# EAGLE design General IO (EAGLE 4.13)
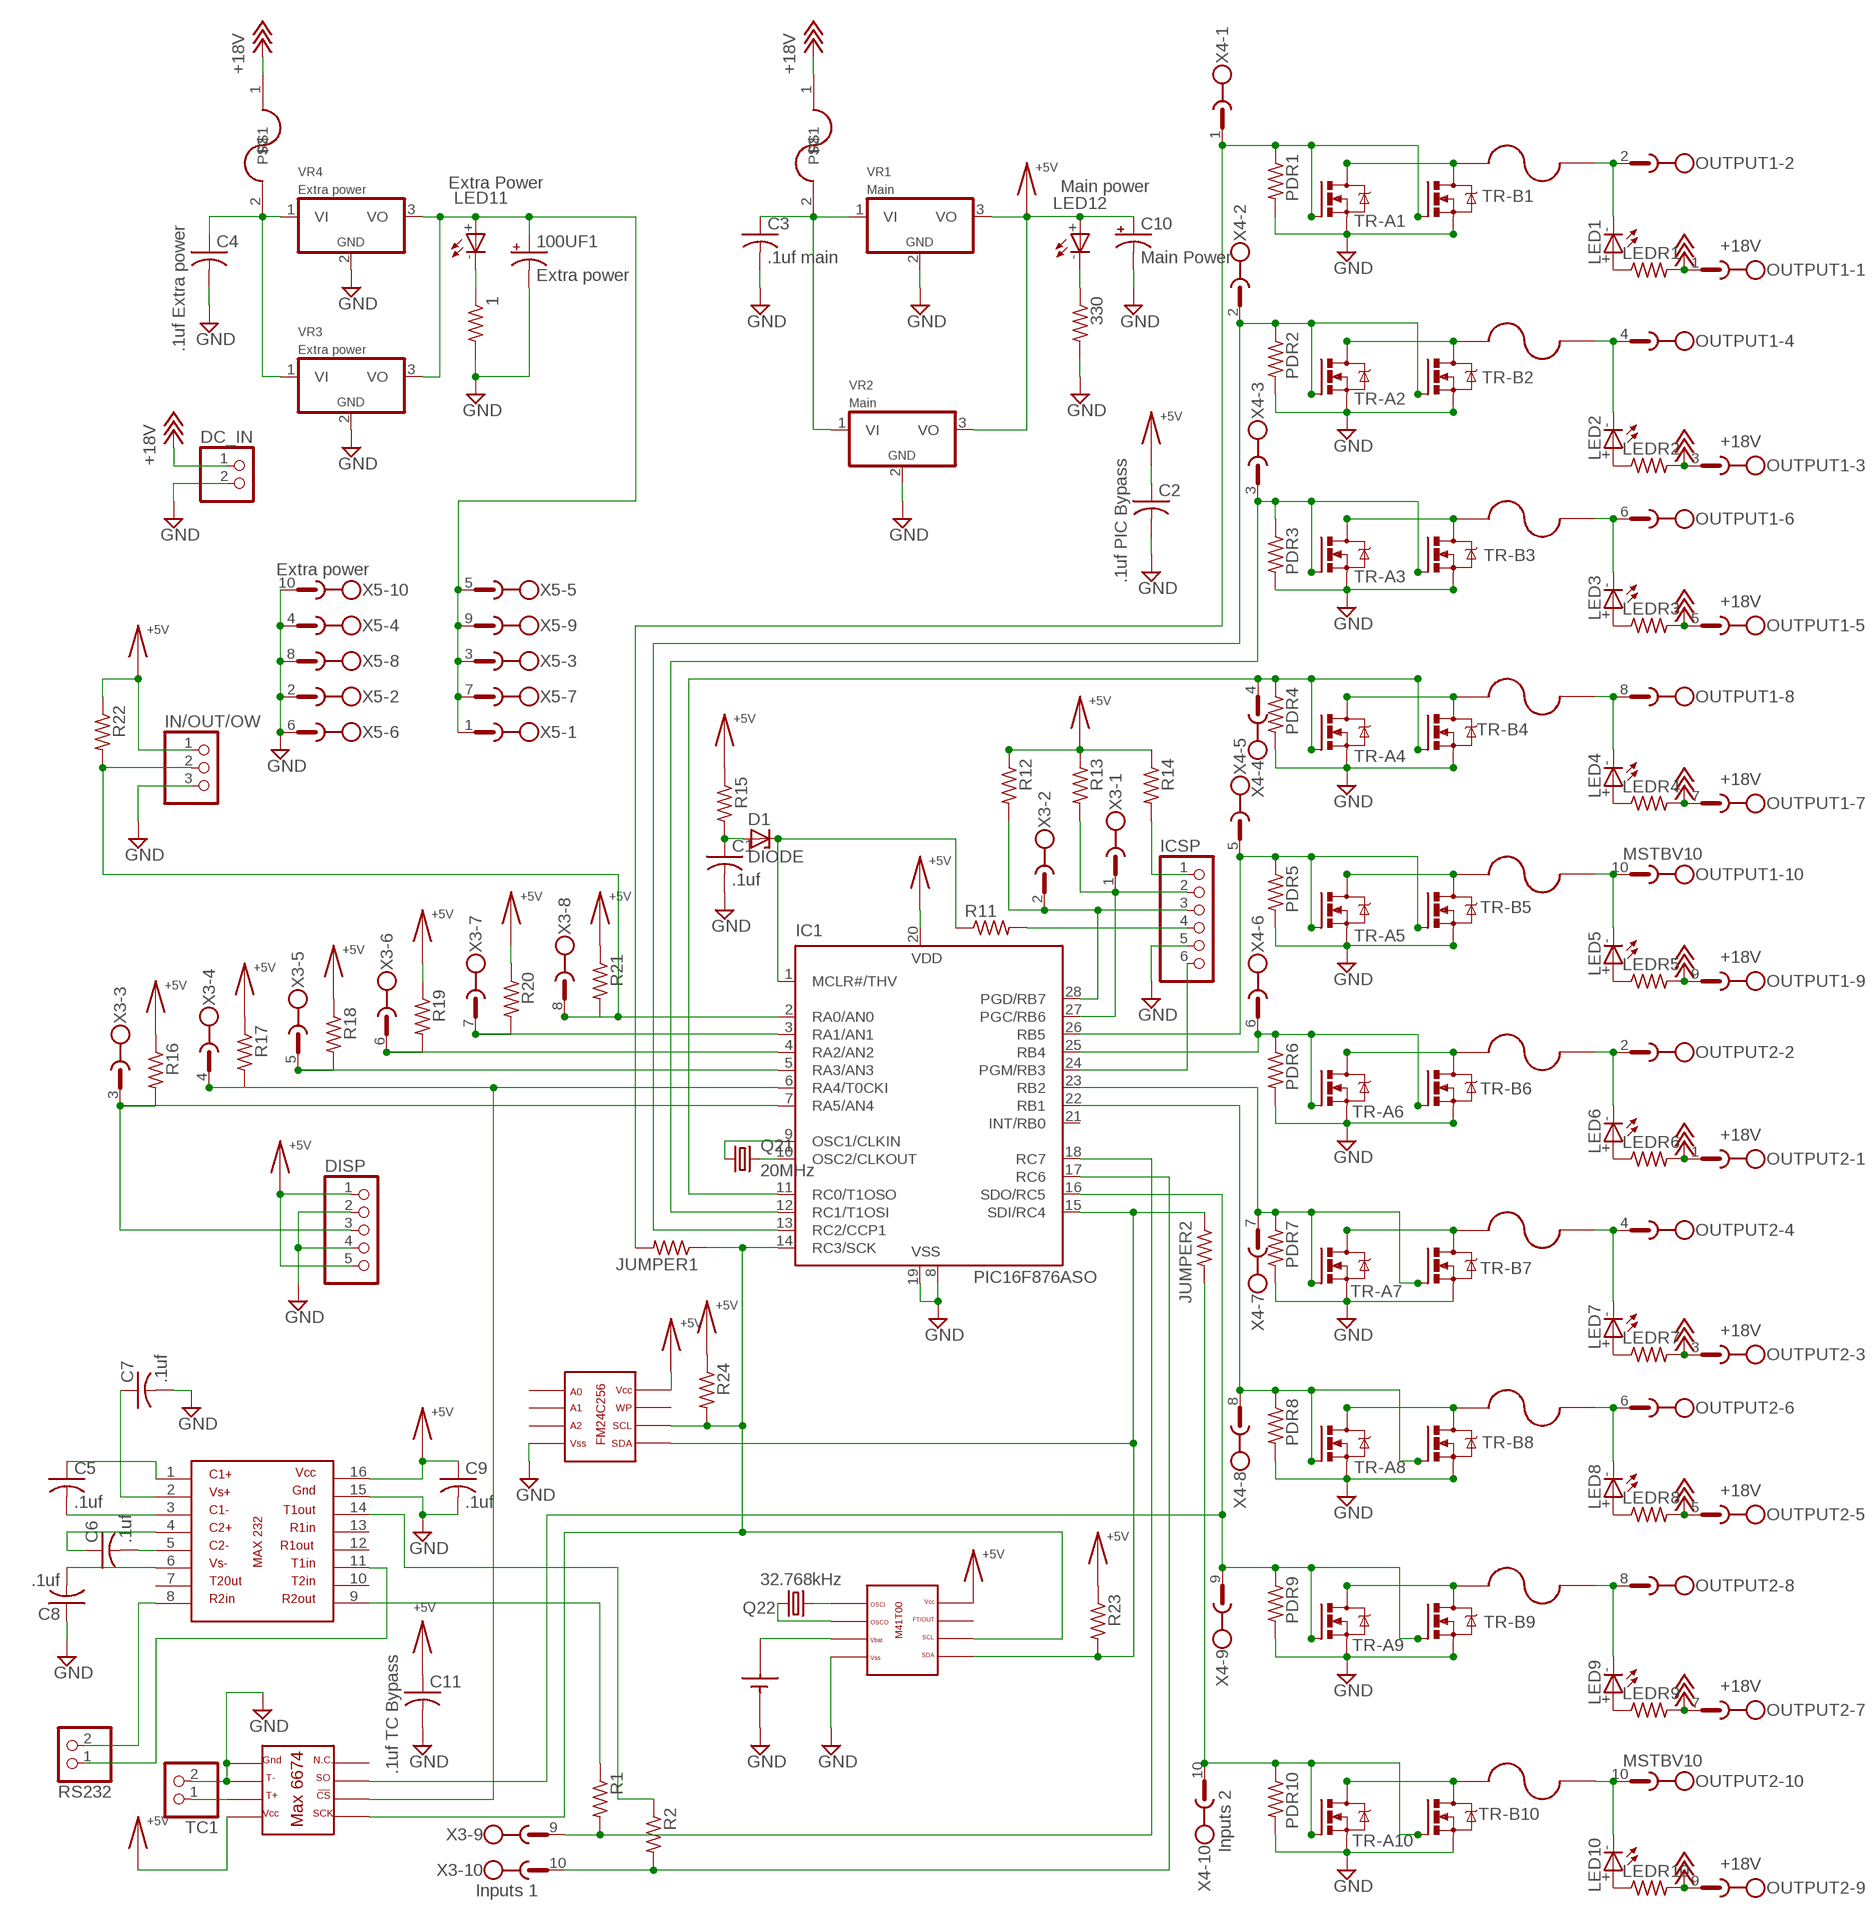
[diagram p0: schematic, sheet 1]

## Parts
1  RESISITORR1210  [R1210]
100UF1  Extra power  CAPACITOR-ELECTROLYTICG  [PANASONIC_G]
330  RESISITORR1210  [R1210]
BAT1  BH-401  [BH-401]
C1  .1uf  CAPACITOR-NO-POLARITYC1210  [C1210]
C2  .1uf PIC Bypass  CAPACITOR-NO-POLARITYC1210  [C1210]
C3  .1uf main  CAPACITOR-NO-POLARITYC1210  [C1210]
C4  .1uf Extra power  CAPACITOR-NO-POLARITYC1210  [C1210]
C5  .1uf  CAPACITOR-NO-POLARITYC1210  [C1210]
C6  .1uf  CAPACITOR-NO-POLARITYC1210  [C1210]
C7  .1uf  CAPACITOR-NO-POLARITYC1210  [C1210]
C8  .1uf  CAPACITOR-NO-POLARITYC1210  [C1210]
C9  .1uf  CAPACITOR-NO-POLARITYC1210  [C1210]
C10  Main Power  CAPACITOR-ELECTROLYTICG  [PANASONIC_G]
C11  .1uf TC Bypass  CAPACITOR-NO-POLARITYC1210  [C1210]
D1  DIODE  DIODE-SWITCHING  [SOT323-W]
DC_IN  PINHD-1X2  [1X02]
DISP  PINHD-1X5  [1X05]
FUSE1  FUSE(SM)  [FUSE]
FUSE2  FUSE(SM)  [FUSE]
FUSE3  FUSE(SM)  [FUSE]
FUSE4  FUSE(SM)  [FUSE]
FUSE5  FUSE(SM)  [FUSE]
FUSE6  FUSE(SM)  [FUSE]
FUSE7  FUSE(SM)  [FUSE]
FUSE8  FUSE(SM)  [FUSE]
FUSE9  FUSE(SM)  [FUSE]
FUSE10  FUSE(SM)  [FUSE]
IC1  PIC16F876ASO  PIC16F876SO  [SO-28W]
ICSP  PINHD-1X6  [1X06]
IN/OUT/OW  PINHD-1X3  [1X03]
JUMPER1  RESISITORM1406  [M1406]
JUMPER2  RESISITORM1406  [M1406]
LED1  LED  [1206]
LED2  LED  [1206]
LED3  LED  [1206]
LED4  LED  [1206]
LED5  LED  [1206]
LED6  LED  [1206]
LED7  LED  [1206]
LED8  LED  [1206]
LED9  LED  [1206]
LED10  LED  [1206]
LED11  Extra Power  LED  [1206]
LED12  Main power  LED  [1206]
LEDR1  RESISITORM1406  [M1406]
LEDR2  RESISITORM1406  [M1406]
LEDR3  RESISITORM1406  [M1406]
LEDR4  RESISITORM1406  [M1406]
LEDR5  RESISITORM1406  [M1406]
LEDR6  RESISITORM1406  [M1406]
LEDR7  RESISITORM1406  [M1406]
LEDR8  RESISITORM1406  [M1406]
LEDR9  RESISITORM1406  [M1406]
LEDR10  RESISITORM1406  [M1406]
OUTPUT1  MSTBV10  [MSTBV10]
OUTPUT2  MSTBV10  [MSTBV10]
PDR1  RESISITORM1406  [M1406]
PDR2  RESISITORM1406  [M1406]
PDR3  RESISITORM1406  [M1406]
PDR4  RESISITORM1406  [M1406]
PDR5  RESISITORM1406  [M1406]
PDR6  RESISITORM1406  [M1406]
PDR7  RESISITORM1406  [M1406]
PDR8  RESISITORM1406  [M1406]
PDR9  RESISITORM1406  [M1406]
PDR10  RESISITORM1406  [M1406]
POLYFUSE1  Extra Power  POLYFUSE  [0204/5]
POLYFUSE2  Main power  POLYFUSE  [0204/5]
Q21  20MHz  CRYSTALSM49  [SM49]
Q22  32.768kHz  CRYSTALTC26H  [TC26H]
R1  RESISITORM1406  [M1406]
R2  RESISITORM1406  [M1406]
R11  RESISITORR1210  [R1210]
R12  RESISITORM1406  [M1406]
R13  RESISITORM1406  [M1406]
R14  RESISITORM1406  [M1406]
R15  RESISITORR1210  [R1210]
R16  RESISITORM1406  [M1406]
R17  RESISITORM1406  [M1406]
R18  RESISITORM1406  [M1406]
R19  RESISITORM1406  [M1406]
R20  RESISITORM1406  [M1406]
R21  RESISITORM1406  [M1406]
R22  RESISITORR1210  [R1210]
R23  RESISITORM1406  [M1406]
R24  RESISITORM1406  [M1406]
RS232  PINHD-1X2  [1X02]
TC1  PINHD-1X2  [1X02]
TR-A1  ZXMN10A08GSOT223  [SOT223R_INFINEON]
TR-A2  ZXMN10A08GSOT223  [SOT223R_INFINEON]
TR-A3  ZXMN10A08GSOT223  [SOT223R_INFINEON]
TR-A4  ZXMN10A08GSOT223  [SOT223R_INFINEON]
TR-A5  ZXMN10A08GSOT223  [SOT223R_INFINEON]
TR-A6  ZXMN10A08GSOT223  [SOT223R_INFINEON]
TR-A7  ZXMN10A08GSOT223  [SOT223R_INFINEON]
TR-A8  ZXMN10A08GSOT223  [SOT223R_INFINEON]
TR-A9  ZXMN10A08GSOT223  [SOT223R_INFINEON]
TR-A10  ZXMN10A08GSOT223  [SOT223R_INFINEON]
TR-B1  ZXMN10A08G  [TO220BV]
TR-B2  ZXMN10A08G  [TO220BV]
TR-B3  ZXMN10A08G  [TO220BV]
TR-B4  ZXMN10A08G  [TO220BV]
TR-B5  ZXMN10A08G  [TO220BV]
TR-B6  ZXMN10A08G  [TO220BV]
TR-B7  ZXMN10A08G  [TO220BV]
TR-B8  ZXMN10A08G  [TO220BV]
TR-B9  ZXMN10A08G  [TO220BV]
TR-B10  ZXMN10A08G  [TO220BV]
U$1  MAX232  [SO16]
U$2  MAX6674  [SO08]
U$4  M41T00TIMER-I2C  [SO08]
U$18  FM24C256  [SO08]
VR1  Main  VOLTAGE-REGULATOR  [TO220S]
VR2  Main  VOLTAGE-REGULATORSO-223  [SOT223R_INFINEON]
VR3  Extra power  VOLTAGE-REGULATORSO-223  [SOT223R_INFINEON]
VR4  Extra power  VOLTAGE-REGULATOR  [TO220S]
X3  Inputs 1  MSTBV10  [MSTBV10]
X4  Inputs 2  MSTBV10  [MSTBV10]
X5  Extra power  MSTBV10  [MSTBV10]

## Nets
+5V: C2.1 C9.1 C10.+ C11.1 DISP.1 DISP.5 IC1.20(VDD) IN/OUT/OW.1 LED12.+ R12.1 R13.1 R14.1 R15.1 R16.1 R17.1 R18.1 R19.1 R20.1 R21.1 R22.1 R23.1 R24.1 U$1.16 U$2.4 U$4.8(VCC) U$18.8(VDD) VR1.3(VO) VR2.3(VO)
+18V: DC_IN.1 LEDR1.2 LEDR2.2 LEDR3.2 LEDR4.2 LEDR5.2 LEDR6.2 LEDR7.2 LEDR8.2 LEDR9.2 LEDR10.2 OUTPUT1.1 OUTPUT1.3 OUTPUT1.5 OUTPUT1.7 OUTPUT1.9 OUTPUT2.1 OUTPUT2.3 OUTPUT2.5 OUTPUT2.7 OUTPUT2.9 POLYFUSE1.1 POLYFUSE2.1
GND: 1.2 100UF1.- 330.2 BAT1.P$2 C1.2 C2.2 C3.2 C4.2 C7.2 C8.1 C9.2 C10.- C11.2 DC_IN.2 DISP.2 DISP.4 IC1.8(VSS) IC1.19(VSS) ICSP.5 IN/OUT/OW.3 PDR1.2 PDR2.2 PDR3.2 PDR4.2 PDR5.2 PDR6.2 PDR7.2 PDR8.2 PDR9.2 PDR10.2 TC1.2 TR-A1.3(S) TR-A2.3(S) TR-A3.3(S) TR-A4.3(S) TR-A5.3(S) TR-A6.3(S) TR-A7.3(S) TR-A8.3(S) TR-A9.3(S) TR-A10.3(S) TR-B1.S TR-B2.S TR-B3.S TR-B4.S TR-B5.S TR-B6.S TR-B7.S TR-B8.S TR-B9.S TR-B10.S U$1.15 U$2.1 U$2.2 U$4.4(VSS) U$18.4(VSS) VR1.2(GND) VR2.2(GND) VR3.2(GND) VR4.2(GND) X5.2 X5.4 X5.6 X5.8 X5.10
N$1: FUSE7.P$1 TR-A7.2(D) TR-B7.D
N$2: FUSE9.P$1 TR-A9.2(D) TR-B9.D
N$3: IC1.25(RB4) PDR6.1 TR-A6.1(G) TR-B6.G X4.6
N$4: FUSE6.P$2 LED6.- OUTPUT2.2
N$5: FUSE7.P$2 LED7.- OUTPUT2.4
N$6: FUSE6.P$1 TR-A6.2(D) TR-B6.D
N$7: FUSE8.P$1 TR-A8.2(D) TR-B8.D
N$8: IC1.23(RB2) PDR7.1 TR-A7.1(G) TR-B7.G X4.7
N$9: FUSE10.P$2 LED10.- OUTPUT2.10
N$10: FUSE8.P$2 LED8.- OUTPUT2.6
N$11: IC1.16(SDO/RC5) PDR9.1 TR-A9.1(G) TR-B9.G U$2.7 X4.9
N$12: IC1.22(RB1) PDR8.1 TR-A8.1(G) TR-B8.G X4.8
N$13: FUSE9.P$2 LED9.- OUTPUT2.8
N$14: FUSE10.P$1 TR-A10.2(D) TR-B10.D
N$15: JUMPER2.2 PDR10.1 TR-A10.1(G) TR-B10.G X4.10
N$16: FUSE2.P$2 LED2.- OUTPUT1.4
N$17: FUSE5.P$1 TR-A5.2(D) TR-B5.D
N$18: FUSE5.P$2 LED5.- OUTPUT1.10
N$19: IC1.24(PGM/RB3) ICSP.6
N$20: IC1.26(RB5) PDR5.1 TR-A5.1(G) TR-B5.G X4.5
N$21: FUSE4.P$1 TR-A4.2(D) TR-B4.D
N$22: FUSE4.P$2 LED4.- OUTPUT1.8
N$23: FUSE3.P$1 TR-A3.2(D) TR-B3.D
N$24: FUSE3.P$2 LED3.- OUTPUT1.6
N$25: IC1.12(RC1/T1OSI) PDR3.1 TR-A3.1(G) TR-B3.G X4.3
N$26: JUMPER1.2 PDR1.1 TR-A1.1(G) TR-B1.G X4.1
N$27: FUSE2.P$1 TR-A2.2(D) TR-B2.D
N$28: IC1.13(RC2/CCP1) PDR2.1 TR-A2.1(G) TR-B2.G X4.2
N$29: FUSE1.P$1 TR-A1.2(D) TR-B1.D
N$30: FUSE1.P$2 LED1.- OUTPUT1.2
N$31: IC1.28(PGD/RB7) ICSP.3 R12.2 X3.2
N$32: IC1.11(RC0/T1OSO) PDR4.1 TR-A4.1(G) TR-B4.G X4.4
N$33: DISP.3 IC1.7(RA5/AN4) R16.2 X3.3
N$34: ICSP.4 R11.2
N$35: IC1.10(OSC2/CLKOUT) Q21.2
N$36: C1.1 D1.1(A) R15.2
N$37: D1.3(C) IC1.1(MCLR#/THV) R11.1
N$38: ICSP.1 R14.2
N$39: IC1.9(OSC1/CLKIN) Q21.1
N$40: IC1.27(PGC/RB6) ICSP.2 R13.2 X3.1
N$41: IC1.6(RA4/T0CKI) R17.2 U$2.6 X3.4
N$42: IC1.5(RA3/AN3) R18.2 X3.5
N$43: IC1.4(RA2/AN2) R19.2 X3.6
N$44: IC1.3(RA1/AN1) R20.2 X3.7
N$45: IC1.2(RA0/AN0) IN/OUT/OW.2 R21.2 R22.2 X3.8
N$46: TC1.1 U$2.3
N$47: IC1.17(RC6) R2.2 X3.10
N$49: IC1.14(RC3/SCK) JUMPER1.1 R24.2 U$2.5 U$4.6(SCL) U$18.6(SCL)
N$52: IC1.15(SDI/RC4) JUMPER2.1 R23.2 U$4.5(SDA) U$18.5(SDA)
N$53: Q22.1 U$4.2(OSCO)
N$54: Q22.2 U$4.1(OSCI)
N$55: 330.1 LED12.-
N$56: BAT1.P$1 U$4.3(VBAT)
N$62: C4.1 POLYFUSE1.2 VR3.1(VI) VR4.1(VI)
N$63: C3.1 POLYFUSE2.2 VR1.1(VI) VR2.1(VI)
N$64: LED10.+ LEDR10.1
N$65: LED9.+ LEDR9.1
N$66: 1.1 LED11.-
N$67: LED8.+ LEDR8.1
N$68: 100UF1.+ LED11.+ VR3.3(VO) VR4.3(VO) X5.1 X5.3 X5.5 X5.7 X5.9
N$69: LED7.+ LEDR7.1
N$70: LED6.+ LEDR6.1
N$71: LED5.+ LEDR5.1
N$72: LED4.+ LEDR4.1
N$73: LED3.+ LEDR3.1
N$74: LED2.+ LEDR2.1
N$75: LED1.+ LEDR1.1
N$80: C6.2 U$1.5
N$81: C5.2 U$1.3
N$82: C6.1 U$1.4
N$83: C5.1 U$1.1
N$84: C7.1 U$1.2
N$85: C8.2 U$1.6
N$86: IC1.18(RC7) R1.2 X3.9
N$87: R1.1 U$1.9
N$88: R2.1 U$1.14
N$89: RS232.1 U$1.11
N$90: RS232.2 U$1.8
Unconnected: IC1.21(INT/RB0) U$1.7 U$1.10 U$1.12 U$1.13 U$2.8 U$4.7(FT/OUT) U$18.1(A0) U$18.2(A1) U$18.3(A2) U$18.7(WP)

## Library data of the parts
1 330 JUMPER1 JUMPER2 LEDR1-LEDR10 PDR1-PDR10 R1 R2 R11-R24 = 1 Dan's Common Parts:RESISITOR: RESISTOR, American symbol
100UF1 C10 = 1 Dan's Common Parts:CAPACITOR-ELECTROLYTIC: POLARIZED CAPACITOR, American symbol
BAT1 = 1 Dan's Common Parts:BH-401
C1-C9 C11 = 1 Dan's Common Parts:CAPACITOR-NO-POLARITY: CAPACITOR, American symbol
D1 = 1 Dan's Common Parts:DIODE-SWITCHING: Z DIODE
DC_IN RS232 TC1 = pinhead:PINHD-1X2: PIN HEADER
DISP = pinhead:PINHD-1X5: PIN HEADER
FUSE1-FUSE10 = 1 Dan's Common Parts:FUSE(SM)
IC1 = 1 Dan's Common Parts:PIC16*876: MICROCONTROLLER flash type
ICSP = pinhead:PINHD-1X6: PIN HEADER
IN/OUT/OW = pinhead:PINHD-1X3: PIN HEADER
LED1-LED12 = 1 Dan's Common Parts:LED
OUTPUT1 OUTPUT2 X3-X5 = con-phoenix-508:MSTBV10: PHOENIX
POLYFUSE1 POLYFUSE2 = 1 Dan's Common Parts:POLYFUSE
Q21 Q22 = 1 Dan's Common Parts:CRYSTAL: CRYSTAL
TR-A1-TR-A10 TR-B1-TR-B10 = 1 Dan's Common Parts:ZXMN10A08G: N-CHANNEL MOS FET
U$1 = 1 Dan's Common Parts:MAX232
U$2 = 1 Dan's Common Parts:MAX6674
U$4 = 1 Dan's Common Parts:M41T00TIMER-I2C
U$18 = 1 Dan's Common Parts:FM24C256
VR1-VR4 = 1 Dan's Common Parts:VOLTAGE-REGULATOR: Positive VOLTAGE REGULATOR Source: http://cache.national.com/ds/LM/LM78L05.pdf http://www.fairchildsemi.com/ds/LM/LM7805.pdf

## Board
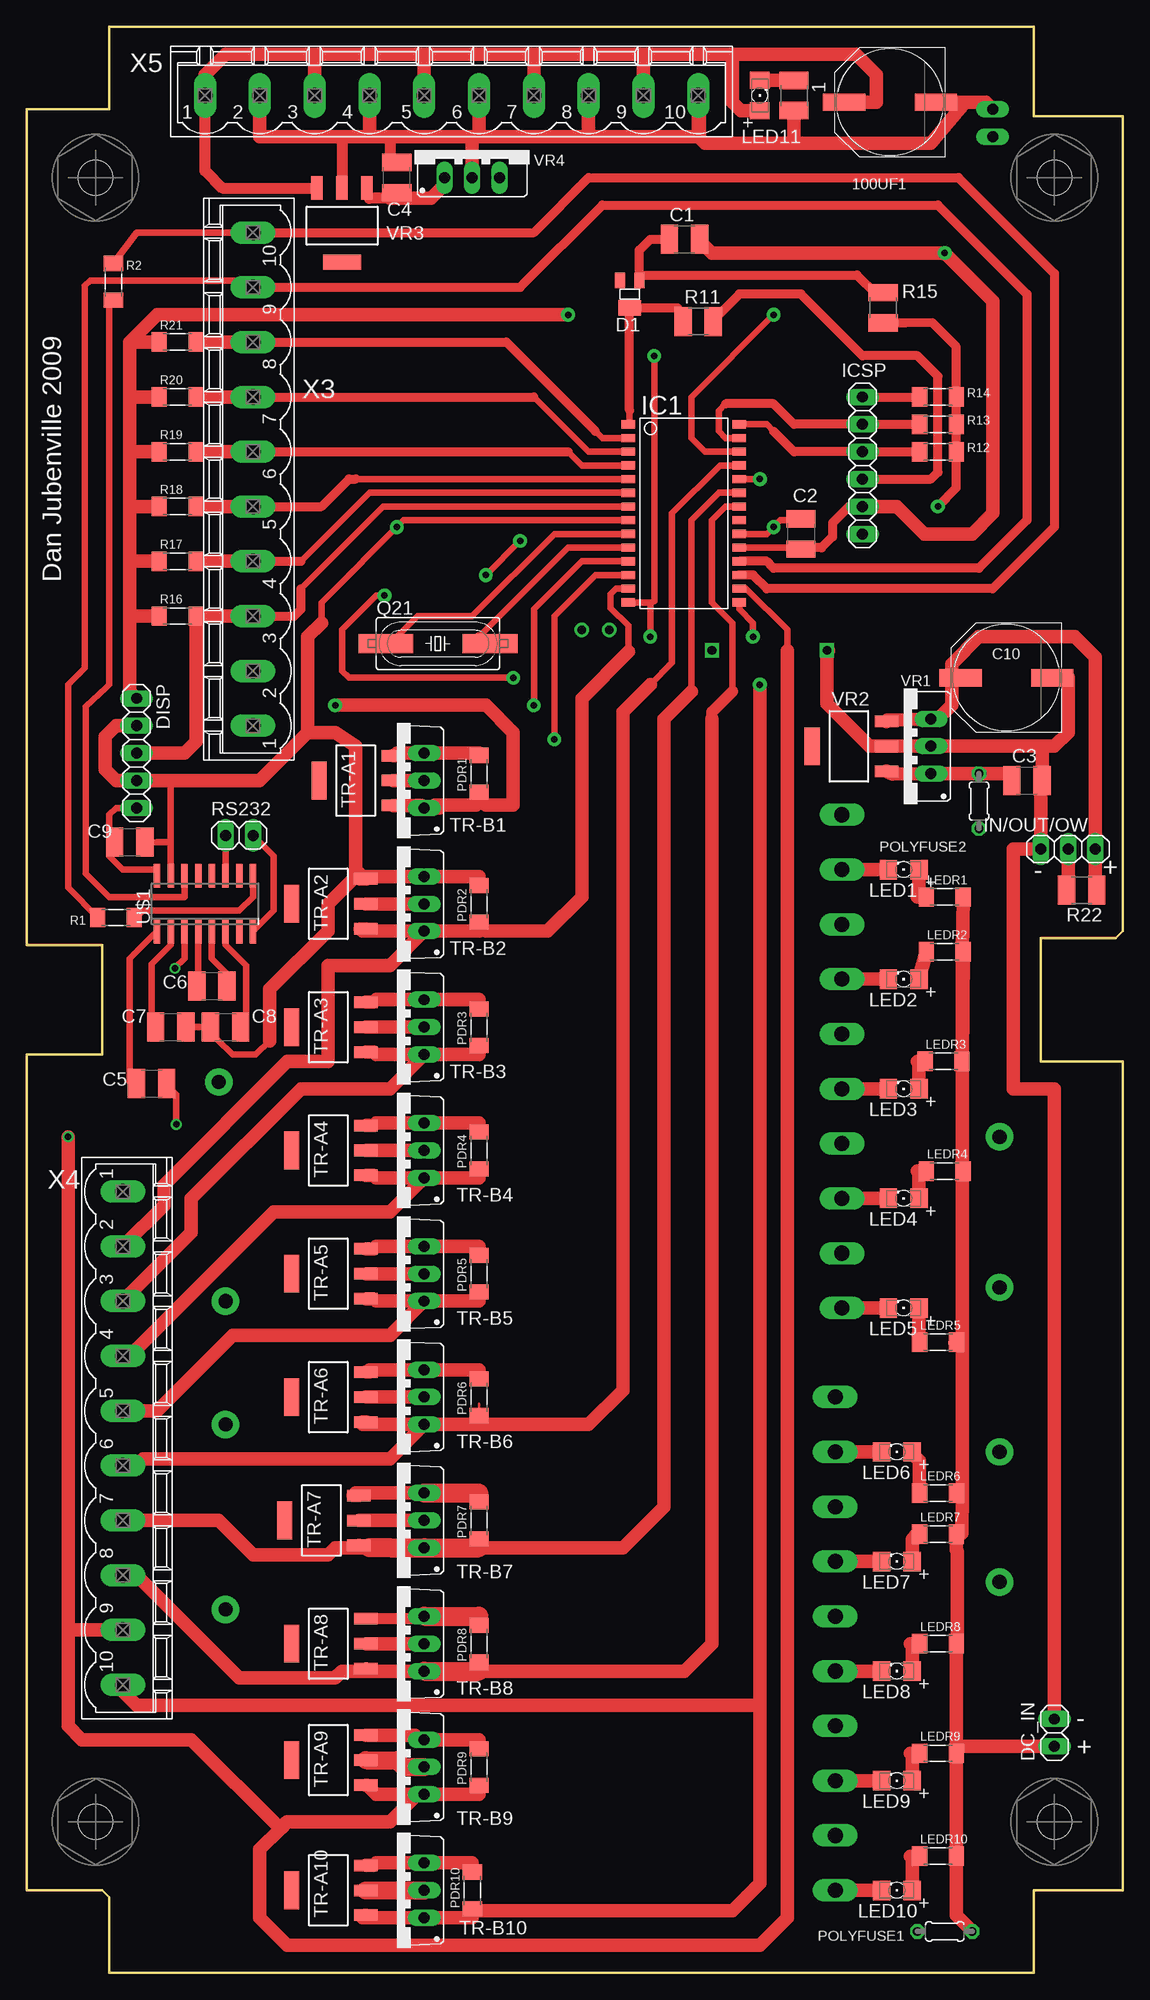
[diagram p1: board, top side]
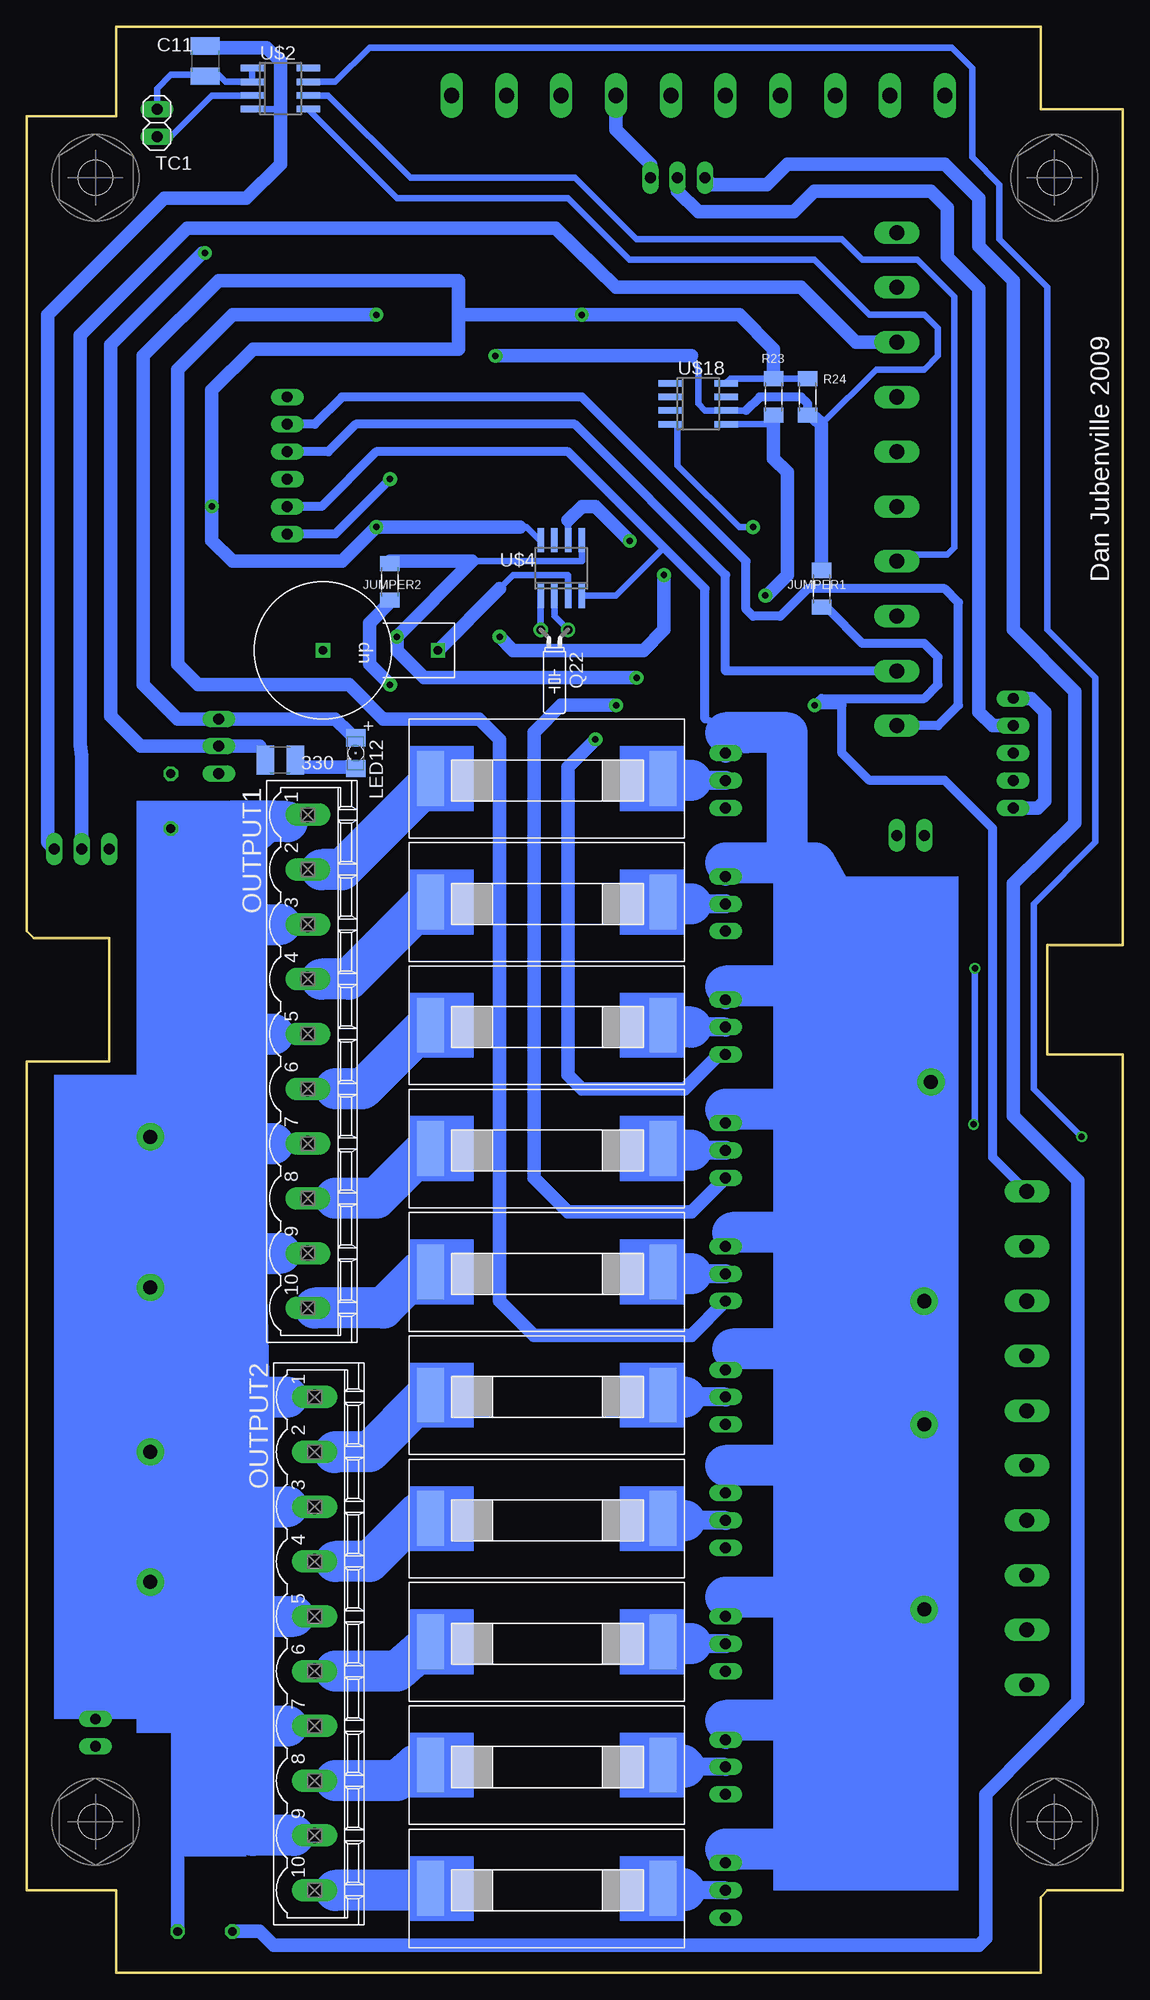
[diagram p2: board, bottom side, seen from below]

Size 101.6 x 180.34 mm. Coordinates in mm from the lower left corner, seen from the top.
Outline: 93.34,0 7.62,0 7.62,6.98 6.99,7.62 0,7.62 0,85.09 6.99,85.09 6.99,95.25 0,95.25 0,172.72 7.62,172.72 7.62,180.34 93.34,180.34 93.34,172.09 101.6,172.09 101.6,96.52 100.97,95.88 93.98,95.88 93.98,84.45 101.6,84.45 101.6,7.62 93.34,7.62 93.34,0
Copper layers (1*16): Top 0.035mm / dielectric 1.5mm / Bottom 0.035mm
Design rules "default": minimum track width 10mil, minimum drill 20mil, track to track 8mil, track to pad 8mil, pad to pad 8mil, via to via 8mil, smd to smd 0mil, copper to edge 20mil, drill to drill 8mil, minimum pad ring 10mil, minimum via ring 8mil, stop-mask expansion 4mil, vias tented up to drill 0mil, thermal gap 10mil

### Footprints (pad centres in the part's own frame; a part is rotated, then mirrored left to right if it is on the bottom)
R1210 = smd 1.6 x 2.7: 1 -1.4,0; 2 1.4,0
PANASONIC_G = smd 3.9 x 1.6: + 4.25,0; - -4.25,0
BH-401 = drill 0.8 square: P$1 0,0; P$2 0,10.668
C1210 = smd 1.6 x 2.7: 1 -1.4,0; 2 1.4,0
SOT323-W = smd 0.9 x 1.45: 1 -0.9,-1.275; 2 0.9,-1.275 | smd 2.1 x 1.45: 3 0,1.275
1X02 = drill 1.016 long: 1 -1.27,0; 2 1.27,0
1X05 = drill 1.016 long: 1 -5.08,0; 2 -2.54,0; 3 0,0; 4 2.54,0; 5 5.08,0
FUSE = smd 2.54 x 5.08: P$1 2,5.54; P$2 23.54,5.54
SO-28W = smd 0.762 x 1.27: 1 -7.62,-5.207; 2 -6.35,-5.207; 3 -5.08,-5.207; 4 -3.81,-5.207; 5 -2.54,-5.207; 6 -1.27,-5.207; 7 0,-5.207; 8 1.27,-5.207; 9 2.54,-5.207; 10 3.81,-5.207; 11 5.08,-5.207; 12 6.35,-5.207; 13 7.62,-5.207; 14 8.89,-5.207; 15 8.89,5.08; 16 7.62,5.08; 17 6.35,5.08; 18 5.08,5.08; 19 3.81,5.08; 20 2.54,5.08; 21 1.27,5.08; 22 0,5.08; 23 -1.27,5.08; 24 -2.54,5.08; 25 -3.81,5.08; 26 -5.08,5.08; 27 -6.35,5.08; 28 -7.62,5.08
1X06 = drill 1.016 long: 1 -6.35,0; 2 -3.81,0; 3 -1.27,0; 4 1.27,0; 5 3.81,0; 6 6.35,0
1X03 = drill 1.016 long: 1 -2.54,0; 2 0,0; 3 2.54,0
M1406 = smd 1.4 x 1.8: 1 -1.7,0; 2 1.7,0
1206 = smd 1.6 x 1.803: + -1.422,0; - 1.422,0
MSTBV10 = drill 1.397 long: 1 -22.86,0; 2 -17.78,0; 3 -12.7,0; 4 -7.62,0; 5 -2.54,0; 6 2.54,0; 7 7.62,0; 8 12.7,0; 9 17.78,0; 10 22.86,0
0204/5 = drill 0.813 octagon: 1 -2.54,0; 2 2.54,0
SM49 = smd 5.08 x 1.778: 1 -4.826,0; 2 4.826,0
TC26H = drill 0.813 round: 1 -1.27,0; 2 1.27,0
SOT223R_INFINEON = smd 1.067 x 2.184: 1 -2.311,-3.479; 2 0,-3.48; 3 2.312,-3.48 | smd 3.5 x 1.4: 4 0,3.404
TO220BV = drill 1.016 long: D 0,-2.54; G -2.54,-2.54; S 2.54,-2.54
SO16 = smd 0.6 x 2.2: 1 -4.445,-2.6; 2 -3.175,-2.6; 3 -1.905,-2.6; 4 -0.635,-2.6; 5 0.635,-2.6; 6 1.905,-2.6; 7 3.175,-2.6; 8 4.445,-2.6; 9 4.445,2.6; 10 3.175,2.6; 11 1.905,2.6; 12 0.635,2.6; 13 -0.635,2.6; 14 -1.905,2.6; 15 -3.175,2.6; 16 -4.445,2.6
SO08 = smd 0.6 x 2.2: 1 -1.905,-2.6; 2 -0.635,-2.6; 3 0.635,-2.6; 4 1.905,-2.6; 5 1.905,2.6; 6 0.635,2.6; 7 -0.635,2.6; 8 -1.905,2.6
SCREW = hole 3.2: 0,0
TO220S = drill 1.016 long: 1 -2.54,-2.54; 2 0,-2.54; 3 2.54,-2.54

### Placement (x,y rotation side)
1  71.12,173.99 270 top
100UF1  80.01,173.36 180 top
330  78.11,112.39 180 bottom
BAT1  63.5,122.55 90 bottom
C1  60.96,160.66 0 top
C2  71.75,133.35 270 top
C3  92.71,110.49 0 top
C4  34.29,166.37 90 top
C5  11.56,82.42 0 top
C6  17.14,91.44 0 top
C7  13.34,87.63 0 top
C8  18.41,87.63 0 top
C9  9.53,104.77 0 top
C10  90.81,120.02 180 top
C11  85.09,177.17 270 bottom
D1  55.88,155.58 180 top
DC_IN  95.25,22.22 90 top
DISP  10.16,113.03 270 top
FUSE1  40.64,116.2 180 bottom
FUSE2  40.64,104.77 180 bottom
FUSE3  40.64,93.34 180 bottom
FUSE4  40.64,81.91 180 bottom
FUSE5  40.64,70.48 180 bottom
FUSE6  40.64,59.05 180 bottom
FUSE7  40.64,47.62 180 bottom
FUSE8  40.64,36.2 180 bottom
FUSE9  40.64,24.77 180 bottom
FUSE10  40.64,13.33 180 bottom
IC1  60.96,135.89 270 top
ICSP  77.47,139.7 270 top
IN/OUT/OW  96.52,104.14 180 top
JUMPER1  27.94,128.27 270 bottom
JUMPER2  67.94,128.91 270 bottom
LED1  81.28,102.23 180 top
LED2  81.28,92.08 180 top
LED3  81.28,81.91 180 top
LED4  81.28,71.75 180 top
LED5  81.28,61.6 180 top
LED6  80.64,48.26 180 top
LED7  80.64,38.1 180 top
LED8  80.64,27.94 180 top
LED9  80.64,17.78 180 top
LED10  80.64,7.62 180 top
LED11  67.94,173.99 90 top
LED12  71.12,113.03 270 bottom
LEDR1  85.09,99.69 0 top
LEDR2  85.09,94.61 0 top
LEDR3  84.96,84.45 0 top
LEDR4  85.09,74.3 0 top
LEDR5  84.45,58.42 0 top
LEDR6  84.45,44.45 0 top
LEDR7  84.45,40.64 0 top
LEDR8  84.45,30.48 0 top
LEDR9  84.45,20.32 0 top
LEDR10  84.45,10.79 0 top
OUTPUT1  75.56,84.45 270 bottom
OUTPUT2  74.93,30.48 270 bottom
PDR1  41.91,111.12 90 top
PDR2  41.91,99.06 90 top
PDR3  41.91,87.63 90 top
PDR4  41.91,76.2 90 top
PDR5  41.91,64.77 90 top
PDR6  41.91,53.34 90 top
PDR7  41.91,41.91 90 top
PDR8  41.91,30.48 90 top
PDR9  41.91,19.05 90 top
PDR10  41.27,7.62 90 top
POLYFUSE1  85.09,3.81 180 top
POLYFUSE2  88.27,108.58 90 top
Q21  38.1,123.19 0 top
Q22  52.7,124.46 180 bottom
R1  8.26,97.79 180 top
R2  8,156.72 90 top
R11  62.23,153.03 0 top
R12  84.45,140.97 180 top
R13  84.45,143.51 180 top
R14  84.45,146.05 180 top
R15  79.38,154.31 90 top
R16  13.97,125.73 0 top
R17  13.97,130.81 0 top
R18  13.97,135.89 0 top
R19  13.97,140.97 0 top
R20  13.97,146.05 0 top
R21  13.97,151.13 0 top
R22  97.79,100.33 180 top
R23  32.38,146.05 270 bottom
R24  29.21,146.05 270 bottom
RS232  19.68,105.41 0 top
TC1  89.53,171.45 90 bottom
TR-A1  30.48,110.49 90 top
TR-A2  27.94,99.06 90 top
TR-A3  27.94,87.63 90 top
TR-A4  27.94,76.2 90 top
TR-A5  27.94,64.77 90 top
TR-A6  27.94,53.34 90 top
TR-A7  27.3,41.91 90 top
TR-A8  27.94,30.48 90 top
TR-A9  27.94,19.68 90 top
TR-A10  27.94,7.62 90 top
TR-B1  34.29,110.49 90 top
TR-B2  34.29,99.06 90 top
TR-B3  34.29,87.63 90 top
TR-B4  34.29,76.2 90 top
TR-B5  34.29,64.77 90 top
TR-B6  34.29,53.34 90 top
TR-B7  34.29,41.91 90 top
TR-B8  34.29,30.48 90 top
TR-B9  34.29,19.05 90 top
TR-B10  34.29,7.62 90 top
U$1  16.51,99.06 0 top
U$2  78.11,174.62 270 bottom
U$4  52.07,130.18 0 bottom
U$11  [SCREW]  6.35,13.97 0 top
U$13  [SCREW]  95.25,13.97 0 top
U$14  [SCREW]  95.25,166.37 0 top
U$15  [SCREW]  6.35,166.37 0 top
U$18  39.37,145.42 270 bottom
VR1  81.28,113.66 90 top
VR2  76.2,113.66 90 top
VR3  29.21,161.93 180 top
VR4  41.27,168.91 0 top
X3  20.95,138.43 90 top
X4  8.89,49.53 270 top
X5  39.37,173.99 0 top

### Tracks (layer width: path | path; a pad name or v marks a point on that pad's centre or on a via)
+5V  (via drill 0.6 pad 1.27)
  Top 0.61: C2.1 70.48,134.62 69.85,134.62 v69.22,133.99 68.58,133.35 IC1.20 | 12.06,101.6 U$1.16 12.06,102.23 8.89,102.23 7.62,103.5 | 7.62,103.5 7.62,107.31 8.26,107.95 DISP.5 | 7.62,103.5 C9.1
  Top 0.813: R15.1 81.41,152.91 83.95,152.91 86.16,150.7 R14.1 86.16,143.72 86.36,143.51 R13.1 86.16,141.4 86.23,141.22 R12.1 86.16,137.62 v84.45,135.89 | 71.37,134.62 71.62,134.62 C2.1
  Top 1.27: 9.53,151.13 R21.1 | 9.53,130.81 9.53,125.73 | 9.53,135.89 9.53,130.81 | 9.53,140.97 9.53,135.89 | 9.53,146.05 9.53,140.97 | 9.53,125.73 R16.1 | 9.53,130.81 R17.1 | 9.53,140.97 R19.1 | 9.53,146.05 R20.1 | 9.53,135.89 R18.1 | 9.53,146.05 9.53,135.89 | 9.53,151.13 9.53,146.05 | 9.53,151.13 12.06,153.67 v50.16,153.67 | VR2.3 79.78,116.1 VR1.3 84.45,116.2 85.72,117.47 85.72,120.02 | 87,120.02 C10.+ 85.72,120.02 | 9.53,125.73 9.53,118.74 DISP.1 | R22.1 99.06,99.69 IN/OUT/OW.1 99.06,121.92 97.16,123.83 88.27,123.83 85.72,121.28 85.72,120.02
  Bottom 0.61: 56.52,133.99 55.88,133.99 55.3,133.99 54.03,132.72 U$4.8 | LED12.+ 71.12,114.3 71.75,114.94 | VR1.3 85.09,116.2 | U$18.8 36.83,147.32 36.4,147.75 R23.1 | R23.1 29.41,147.75 29.21,147.96 R24.1 R23.1 | R23.1 33.23,147.75 | 35.35,147.75 32.59,147.75 32.38,147.96 R23.1 | 85.09,178.44 C11.1 | 78.11,172.72 U$2.4
  Bottom 1.27: 61.59,153.03 61.59,153.67 v50.16,153.67 35.56,153.67 32.38,150.5 32.38,147.96 | 61.59,153.03 61.59,156.84 83.82,156.84 90.81,149.86 90.81,119.38 87.63,116.2 VR1.3 73.03,116.2 71.75,114.94 | 61.59,153.03 61.59,150.5 80.64,150.5 84.45,146.69 v84.45,135.89 84.45,132.72 82.55,130.81 72.39,130.81 v69.22,133.99 55.88,133.99 | DISP.1 8.51,118.11 7.24,116.84 7.24,108.58 7.87,107.95 DISP.5 8.26,107.95 | 85.09,178.44 79.38,178.44 78.11,177.17 78.11,172.72 78.11,167.64 81.28,164.47 88.9,164.47 99.69,153.67 99.69,104.77 IN/OUT/OW.1
+18V
  Top 1.27: POLYFUSE1.1 86.16,5.29 LEDR10.2 86.16,10.87 86.11,10.92 86.16,10.97 LEDR9.2 86.11,20.57 86.16,20.91 | 86.74,94.61 LEDR2.2 | 86.74,94.61 86.79,94.54 86.74,84.45 86.74,85.09 | 86.16,20.91 86.16,30.66 | 86.16,30.66 LEDR8.2 86.23,31.37 | 86.23,31.37 86.23,38.99 86.16,39.17 LEDR7.2 86.66,40.69 86.74,44.45 | 86.16,30.66 86.23,31.37 | 86.74,94.61 LEDR1.2 | 86.74,44.45 LEDR6.2 | 86.74,44.45 86.74,57.79 | 86.74,57.79 86.74,73.66 | 86.74,73.66 86.74,85.09 | 86.74,85.09 86.74,94.61 | LEDR5.2 86.03,58.37 86.74,57.79 | LEDR4.2 86.79,74.25 86.74,73.66 | 86.74,85.09 LEDR3.2 | 86.16,20.91 86.36,20.91 86.36,20.95 DC_IN.1
  Bottom 1.27: 77.47,106.68 81.28,106.68 83.19,105.41 85.72,106.05 POLYFUSE2.1 | 77.47,106.68 78.8,106.74 78.8,106.76 | POLYFUSE1.1 87.63,97.79 77.47,106.68 | 80.64,53.34 80.64,50.8 86.36,45.09 88.27,44.45
  Bottom 1.778: 78.74,22.86 OUTPUT2.7 | OUTPUT2.9 76.83,12.7 | 76.83,33.02 OUTPUT2.5 | 77.47,43.18 OUTPUT2.3 | 77.47,53.34 OUTPUT2.1 | 77.47,106.68 78.11,107.31 OUTPUT1.1 | 78.11,97.16 OUTPUT1.3 | 78.74,86.99 OUTPUT1.5 | 78.74,76.83 OUTPUT1.7 | 78.11,66.67 OUTPUT1.9
  Bottom 3.81: 77.47,53.34 80.64,53.34 80.64,40.01 | 80.64,33.02 80.64,40.01 | 80.64,40.01 80.64,43.18 77.47,43.18 | 80.64,33.02 76.83,33.02 | 77.47,22.86 78.74,22.86 80.64,22.86 80.64,23.5 | 80.64,23.5 80.64,33.02 | 76.83,12.7 80.64,12.7 80.64,23.5 | 77.47,106.68 82.55,106.68 82.47,106.76 78.8,106.76 81.28,106.68 81.28,97.16 | 81.28,86.99 81.28,97.16 | 81.28,76.83 81.28,86.99 | 81.28,66.67 81.28,76.83 | 81.28,97.16 78.11,97.16 | 81.28,86.99 78.74,86.99 | 81.28,76.83 78.74,76.83 | 81.28,66.67 78.11,66.67 | 80.64,40.01 81.28,66.67
GND  (via drill 0.6 pad 1.27)
  Top 0.254: TR-A2.3 30.48,100.96
  Top 0.61: 41.91,44.45 PDR7.2 | 41.91,33.02 PDR8.2 | IC1.19 70.48,132.08 | 27.3,125.09 27.3,127 34.92,134.62 | 34.92,134.62 IC1.8 | C2.2 71.75,132.08 IC1.19 | 73.66,132.08 IC1.19 | 74.17,121.79 74.3,122.55 | 34.92,134.62 v34.29,133.99 | C7.2 14.73,87.5 15.24,87.63 C8.1 17.65,86.49 19.05,85.09 21.21,85.09 22.48,86.36 | 13.34,104.77 U$1.15 | 13.34,110.49 13.34,104.77 | C9.2 10.93,104.64 12.06,104.77 13.34,104.77
  Top 0.813: ICSP.5 76.2,135.89 74.68,134.37 74.68,133.1 73.66,132.08 71.75,132.08 70.61,132.08 C2.2 | 94.61,113.66 94.11,113.53 | 96.52,120.02 C10.-
  Top 1.016: TR-A8.3 36.6,32.79 TR-B8.S | VR3.2 29.21,170.18 31.11,170.18 | 33.66,170.18 33.66,167.77 | 33.66,167.77 33.66,167.64 | 33.66,167.77 C4.2
  Top 1.27: TR-A7.3 30.25,44.22 30.48,44.45 TR-B7.S | PDR9.2 41.91,21.59 TR-B9.S 36.2,21.59 35.97,22 TR-A9.3 | TR-A10.3 32.16,9.93 32.38,10.16 TR-B10.S | TR-B10.S 37.47,10.16 | PDR10.2 41.27,10.16 TR-B10.S | TR-A6.3 31.75,55.65 31.75,55.88 TR-B6.S 41.91,55.88 PDR6.2 | TR-A5.3 32.16,67.08 32.38,67.31 TR-B5.S 41.91,67.31 PDR5.2 | TR-A4.3 32.16,78.51 32.38,78.74 TR-B4.S 41.91,78.74 PDR4.2 | PDR3.2 41.91,90.17 TR-B3.S 32.38,90.17 32.16,89.94 TR-A3.3 | TR-A2.3 30.89,101.37 30.48,101.6 | 30.48,101.6 TR-B2.S 41.91,101.6 PDR2.2 | TR-A1.3 34.06,112.8 34.29,113.03 TR-B1.S 41.91,113.03 PDR1.2 | C1.2 62.36,160.53 63.5,159.39 v85.09,159.39 89.53,154.94 89.53,135.26 87.63,133.35 83.19,133.35 80.64,135.89 ICSP.5 | 26.04,114.94 26.04,123.83 27.3,125.09 | 26.04,114.94 21.59,110.49 13.34,110.49 DISP.4 8.26,110.49 7.24,111.51 7.24,114.55 8.26,115.57 DISP.2 | 26.04,114.94 28.57,114.94 30.48,113.66 30.48,101.6 | 94.11,113.53 C3.2 93.98,110.49 IN/OUT/OW.3 91.44,104.14 91.44,81.91 95.25,81.91 DC_IN.2 | 74.3,122.55 BAT1.P$2 | 74.17,121.79 74.17,117.6 78.11,113.66 78.74,113.66 VR2.2 80.26,113.66 81.53,113.66 VR1.2 94.61,113.66 95.25,113.66 96.52,114.94 96.52,120.02 | 31.75,170.18 X5.4 | 41.27,170.18 41.91,170.18 | 33.66,170.18 41.27,170.18 | 41.91,170.18 X5.6 | 52.07,170.18 41.91,170.18 | 52.07,170.18 X5.8 | 62.23,170.18 52.07,170.18 | 62.23,170.18 62.23,173.36 62.36,173.99 | 62.36,173.99 62.23,174.62 62.23,173.86 62.36,173.99 | 62.36,173.99 X5.10 | 62.36,173.99 62.36,170.31 62.23,170.18 | 71.12,169.55 83.82,169.55 87,173.36 | 71.12,169.55 62.87,169.55 62.23,170.18 | 71.12,169.55 1.2 | 41.27,170.18 VR4.2 | 62.23,170.18 33.66,170.18
  Top 1.27: 33.66,170.18 31.75,170.18 | 31.75,170.18 31.11,170.18 21.59,170.18 X5.2 | 22.48,86.36 22.48,91.19 27.94,96.52 27.94,99.06 30.48,101.6 | 30.48,101.6 30.8,101.92 | 87,173.36 100UF1.- | 87,173.36 88.9,173.36 TC1.2
  Top 1.778: TR-B8.S 41.91,33.02 | TR-B7.S 41.91,44.45
  Bottom 0.254: 22.23,70.48 22.48,57.79
  Bottom 0.61: U$4.4 50.16,127.63 46.99,127.63 42.55,132.08 | 36.83,114.94 37.34,115.44 37.47,115.06 | 34.92,114.94 38.73,116.2 | 330.2 79.5,113.16 80.01,113.66 | U$18.4 41.27,143.51 41.27,139.7 35.56,133.99 v34.29,133.99 | 85.09,175.9 C11.2 | 85.09,175.9 83.82,175.9 83.19,175.26 U$2.2 80.64,175.26 80.7,175.32 U$2.1 | 85.09,175.9 88.27,175.9 89.53,174.62 TC1.2
  Bottom 0.813: ICSP.5 74.3,135.89 69.22,140.97 51.44,140.97 42.55,132.08 38.73,128.27 38.73,116.2
  Bottom 1.27: 36.83,11.43 TR-B10.S | 36.6,33.43 TR-B8.S 36.83,34.8 | 36.83,46.99 TR-B7.S | 36.2,57.79 TR-B6.S | 36.2,68.58 TR-B5.S | 36.83,80.01 TR-B4.S | 80.01,113.66 VR1.2 91.06,113.66 93.85,116.46 93.85,150.88 85.34,159.39 v85.09,159.39 | DISP.2 12.06,115.57 13.34,116.84 13.34,156.08 16.26,159 16.26,163.58 17.78,165.1 28.57,165.1 30.48,163.2 39.37,163.2 41.27,165.1 VR4.2
  Bottom 1.778: 36.83,114.94 TR-B1.S | 36.83,23.37 TR-B9.S | 36.83,91.44 TR-B3.S | TR-B2.S 36.83,102.87
  Bottom 3.81: 36.83,11.43 22.23,11.43 22.23,23.37 | 31.11,102.87 31.11,114.94 34.92,114.94 36.83,114.94 | 22.23,91.44 22.23,80.01 | 22.23,70.48 22.23,58.67 | 22.23,80.01 22.23,70.48 | 22.23,58.67 22.23,46.99 | 22.23,46.99 22.23,34.8 | 22.23,34.8 22.23,23.37 | 22.23,23.37 36.83,23.37 | 22.23,34.8 36.83,34.8 36.7,34.67 | 22.23,46.99 36.83,46.99 | 22.23,58.67 22.48,57.79 36.2,57.79 | 22.23,70.48 22.86,68.58 36.2,68.58 | 22.23,80.01 36.83,80.01 | 22.23,91.44 36.83,91.44 | 22.23,91.44 28.57,102.87 31.11,102.87 | 36.83,102.87 31.11,102.87
N$1
  Top 1.27: TR-A7.2 TR-B7.D
  Bottom 1.778: TR-B7.D 40.64,41.91
  Bottom 3.81: FUSE7.P$1 41.91,41.91 40.64,41.91
N$2
  Top 1.676: TR-A9.2 34.29,19.68 34.92,19.05 TR-B9.D
  Bottom 1.676: TR-B9.D 40.64,19.05
  Bottom 3.81: FUSE9.P$1 40.81,19.22 40.64,19.05
N$3
  Top 0.254: 41.91,51.44 PDR6.1 41.91,52.71
  Top 0.61: IC1.25 64.26,139.7 59.82,135.26 59.82,121.41 57.78,119.38
  Top 1.27: TR-B6.G 41.27,50.8 | 41.27,50.8 41.91,51.44 | TR-A6.1 31.11,51.03 31.11,50.8 TR-B6.G | 57.78,119.38 55.24,116.84 55.24,53.98 52.07,50.8 41.27,50.8 | X4.6 10.16,46.99 10.79,47.62 33.66,47.62 TR-B6.G
N$4
  Top 1.27: OUTPUT2.2 LED6.-
  Bottom 1.778: 73.03,48.26 OUTPUT2.2 75.56,48.26
  Bottom 3.81: FUSE6.P$2 64.59,53.52 64.14,53.34 64.77,53.34 69.85,48.26 73.03,48.26 73.09,48.2
N$5
  Top 1.27: 79.38,38.1 LED7.- OUTPUT2.4
  Bottom 1.778: 73.03,38.1 OUTPUT2.4
  Bottom 3.81: 73.03,38.1 69.85,38.1 65.41,42.55 64.14,42.55 64.18,42.5 FUSE7.P$2
N$6
  Top 1.27: TR-A6.2 31.75,53.34 TR-B6.D
  Bottom 1.778: TR-B6.D 40.64,53.34
  Bottom 3.81: FUSE6.P$1 41.91,53.34 40.64,53.34
N$7
  Top 1.27: TR-A8.2 TR-B8.D
  Bottom 1.778: TR-B8.D 40.01,30.48
  Bottom 3.81: 40.01,30.48 43.18,30.48 43.01,30.66 FUSE8.P$1
N$8
  Top 0.61: 41.91,39.37 PDR7.1 | IC1.23 64.14,137.16 61.59,134.62 61.59,118.74
  Top 1.27: TR-A7.1 31.11,39.37 31.75,39.37 | 61.59,118.74 59.05,116.2 59.05,43.18 55.24,39.37 41.91,39.37 | X4.7 17.78,41.91 20.95,38.74 27.94,38.74 28.57,39.37 33.66,39.37
  Top 1.778: 31.75,39.37 33.66,39.37 TR-B7.G 41.91,39.37
N$9
  Top 1.27: 79.38,7.62 LED10.- OUTPUT2.10
  Bottom 0.406: FUSE10.P$2 64.18,7.66 64.14,7.62
  Bottom 1.778: 73.03,7.62 OUTPUT2.10
  Bottom 3.81: 64.14,7.62 73.03,7.62
N$10
  Top 1.27: LED8.- OUTPUT2.6 74.3,27.94
  Bottom 1.778: 73.03,27.94 OUTPUT2.6 75.56,27.94
  Bottom 3.81: FUSE8.P$2 67.31,27.94 73.03,27.94
N$11  (via drill 0.6)
  Top 0.61: IC1.16 66.67,128.27 70.48,124.46 70.48,122.55
  Top 1.27: TR-A9.1 31.52,17.37 32.38,16.51 36.2,16.51 | 70.48,122.55 70.48,5.08 67.94,2.54 24.13,2.54 21.59,5.08 21.59,11.43 23.5,13.33 | 23.5,13.33 24.13,13.97 33.66,13.97 36.2,16.51 | 36.2,16.51 TR-B9.G | PDR9.1 41.91,16.51 36.2,16.51 | 3.81,31.75 3.81,22.86 5.08,21.59 15.24,21.59 23.5,13.33 | 3.81,31.75 v3.81,77.47 | 3.81,31.75 X4.9
  Bottom 0.61: U$2.7 73.03,175.26 69.85,178.44 15.88,178.44 13.97,176.53 13.97,168.28 11.43,165.74 11.43,160.66 6.99,156.21 6.99,124.46 2.54,120.02 2.54,104.77 8.26,99.06 8.26,81.91 v3.81,77.47
N$12
  Top 0.61: 41.91,27.94 PDR8.1 | IC1.22 64.77,135.89 63.5,134.62 63.5,127 65.41,125.09 65.41,118.74
  Top 1.016: 63.5,116.2 63.5,116.84 65.41,118.74
  Top 1.27: TR-A8.1 31.75,27.94 34.92,27.94 | 34.92,27.94 TR-B8.G | 63.5,116.2 63.5,30.48 60.96,27.94 41.91,27.94 | X4.8 10.16,36.83 19.68,27.3 28.57,27.3 29.21,27.94 34.92,27.94
  Top 1.778: TR-B8.G 41.91,27.94
N$13
  Top 1.27: OUTPUT2.8 LED9.-
  Bottom 1.778: 73.03,17.78 OUTPUT2.8
  Bottom 3.81: FUSE9.P$2 65.58,19.22 67.31,17.78 73.03,17.78
N$14
  Top 1.676: TR-A10.2 TR-B10.D | TR-B10.D
  Bottom 1.676: TR-B10.D 40.64,7.62
  Bottom 3.81: FUSE10.P$1 40.81,7.79 40.64,7.62
N$15  (via drill 0.6 pad 1.27)
  Top 0.813: X4.10 8.26,26.67
  Top 1.27: TR-A10.1 31.34,5.31 31.11,5.08 TR-B10.G 41.27,5.08 41.27,5.71 | 67.94,24.77 67.94,8.26 65.41,5.71 41.27,5.71 | 67.94,24.77 v67.94,119.38 | 41.27,5.71 PDR10.1 | 8.26,26.67 10.16,24.77 67.94,24.77
  Bottom 0.61: 67.74,127.2 JUMPER2.2
  Bottom 1.27: 67.74,127.2 69.85,125.09 69.85,121.28 v67.94,119.38
N$16
  Top 1.27: OUTPUT1.4 74.93,92.08 | OUTPUT1.4 LED2.- | LED2.- 80.01,92.08 | OUTPUT1.4 LED2.-
  Bottom 1.778: 74.3,92.08 OUTPUT1.4
  Bottom 3.81: FUSE2.P$2 63.33,98.6 62.87,99.06 64.77,99.06 71.75,92.08 74.3,92.08
N$17
  Top 1.27: TR-A5.2 TR-B5.D | TR-B5.D
  Bottom 1.778: TR-B5.D 40.01,64.77
  Bottom 3.81: FUSE5.P$1 42.64,64.86 42.55,64.77 40.01,64.77
N$18
  Top 1.27: OUTPUT1.10 LED5.-
  Bottom 1.778: 74.93,61.6 OUTPUT1.10
  Bottom 3.81: FUSE5.P$2 65.23,64.94 68.58,61.6 74.93,61.6
N$19  (via drill 0.6 pad 1.27)
  Top 0.61: IC1.24 v67.94,138.43
  Bottom 0.813: v67.94,138.43 73.03,133.35 ICSP.6
N$20  (via drill 0.6 pad 1.27)
  Top 0.61: IC1.26 62.87,140.97 61.59,142.24 61.59,146.05 v69.22,153.67
  Top 1.27: TR-A5.1 32.16,62.46 32.38,62.23 TR-B5.G | TR-B5.G 41.91,62.23 PDR5.1 | X4.5 12.06,52.07 19.05,59.05 33.66,59.05 TR-B5.G
  Bottom 1.27: v69.22,153.67 82.55,153.67 87.63,148.59 87.63,121.28 85.72,119.38 71.75,119.38 68.58,116.2 59.69,116.2 57.78,114.3 57.78,62.23 54.61,59.05 40.01,59.05 TR-B5.G 36.2,62.23
N$21
  Top 1.27: TR-A4.2 TR-B4.D | TR-B4.D
  Bottom 1.778: TR-B4.D 40.01,76.2
  Bottom 3.81: FUSE4.P$1 42.64,76.3 42.55,76.2 40.01,76.2
N$22
  Top 1.27: OUTPUT1.8 LED4.-
  Bottom 1.778: 73.03,71.75 OUTPUT1.8
  Bottom 3.81: 64.14,76.83 69.22,71.75 73.03,71.75 | 64.14,76.83 63.5,76.83 | 64.14,76.83 63.5,76.2 64.14,76.2 64.18,76.24 FUSE4.P$2
N$23
  Top 1.27: TR-A3.2 37.47,87.63 | 37.47,87.63 | 37.47,87.63 TR-B3.D
  Bottom 1.778: TR-B3.D 40.01,87.63
  Bottom 3.81: FUSE3.P$1 42.64,87.72 42.55,87.63 40.01,87.63
N$24
  Top 1.27: LED3.- OUTPUT1.6 74.93,81.91
  Bottom 1.778: 73.03,81.91 OUTPUT1.6
  Bottom 3.81: FUSE3.P$2 64.18,87.67 64.14,87.63 64.14,88.27 70.48,81.91 73.03,81.91
N$25  (via drill 0.6 pad 1.27)
  Top 0.61: IC1.12 52.7,129.54 48.9,125.73 v48.9,114.3
  Top 1.27: TR-B3.G 41.91,85.09 PDR3.1 | TR-A3.1 32.16,85.32 32.38,85.09 TR-B3.G | X4.3 15.24,68.58 15.24,71.75 25.4,81.91 33.66,81.91 TR-B3.G
  Bottom 1.27: v48.9,114.3 51.44,111.76 51.44,83.19 50.16,81.91 40.64,81.91 37.47,85.09 TR-B3.G
N$26  (via drill 0.6 pad 1.27)
  Top 0.61: TR-B1.G 36.6,108.18 | 37.85,108.2 38.23,107.95 | 41.66,108.2 41.76,108.62 41.91,109.22 PDR1.1
  Top 1.27: PDR1.1 42.12,109.22 | 36.6,108.18 TR-A1.1 | 38.23,107.95 TR-B1.G | 41.66,108.2 37.85,108.2 | v28.57,117.47 42.55,117.47 45.09,114.94 45.09,108.2 42.55,108.2 41.87,108.62 41.76,108.62
  Bottom 0.813: X4.1 12.06,75.56 12.06,106.05 16.51,110.49 23.5,110.49 26.04,113.03 26.04,117.47 v28.57,117.47 27.94,118.11 18.41,118.11 17.14,119.38 17.14,121.92 18.41,123.19 24.13,123.19 27.3,126.36 27.94,126.36 JUMPER1.2
N$27
  Top 1.27: TR-A2.2 37.47,99.06 TR-B2.D
  Bottom 1.27: FUSE2.P$1 41.45,99.23 41.27,99.06
  Bottom 1.778: TR-B2.D 40.01,99.06
  Bottom 3.81: 40.01,99.06 41.27,99.06 41.91,99.06 42.55,99.69
N$28
  Top 0.61: IC1.13 54.61,128.27 54.1,127.76 54.1,126.49 55.75,124.84 55.75,122.43
  Top 1.27: TR-A2.1 30.89,96.75 31.11,96.52 TR-B2.G | PDR2.1 41.91,97.16 42.23,96.84 | TR-B2.G 41.91,96.52 42.23,96.84 | 55.75,122.43 51.44,118.11 51.44,99.69 48.26,96.52 42.55,96.52 42.23,96.84 | X4.2 12.7,71.12 12.7,73.02 24.13,84.45 27.94,84.45 27.94,93.34 33.66,93.34 TR-B2.G
N$29
  Top 1.27: TR-A1.2 TR-B1.D | TR-B1.D
  Bottom 1.778: TR-B1.D 40.01,110.49
  Bottom 3.81: FUSE1.P$1 42.64,110.58 41.91,111.12 42.55,110.49 40.01,110.49
N$30
  Top 1.27: OUTPUT1.2 LED1.-
  Bottom 1.778: 74.3,102.23 OUTPUT1.2
  Bottom 3.81: FUSE1.P$2 63.96,110.66 72.39,102.23 74.3,102.23
N$31
  Top 0.61: 69.22,142.88 68.58,143.51 IC1.28
  Top 0.813: R12.2 ICSP.3 71.12,140.97 69.22,142.88
  Bottom 0.813: X3.2 36.83,120.65 36.83,129.54 50.8,143.51 71.12,143.51 73.66,140.97 ICSP.3
N$32  (via drill 0.6 pad 1.27)
  Top 0.61: v46.99,117.47 46.99,126.36 51.44,130.81 IC1.11 | X4.4 9.53,57.15
  Top 1.27: TR-A4.1 32.16,73.89 32.38,73.66 TR-B4.G | TR-B4.G 41.91,73.66 PDR4.1 | 9.53,57.15 22.86,70.48 33.66,70.48 TR-B4.G
  Bottom 1.27: v46.99,117.47 52.07,117.47 54.61,114.94 54.61,73.66 51.44,70.48 40.01,70.48 TR-B4.G
N$33
  Top 0.61: IC1.7 33.02,135.89 25.4,128.27
  Top 0.813: 25.4,128.27 25.4,126.36 24.77,125.73 X3.3
  Top 1.27: X3.3 R16.2 15.67,114.09 14.61,113.03 DISP.3
N$34
  Top 0.813: ICSP.4 83.82,138.43 84.45,139.06 84.45,147.96 82.55,149.86 77.47,149.86 71.75,155.58 66.04,155.58 63.5,153.03 R11.2 64.14,153.67
N$35
  Top 0.61: 41.91,123.83 50.16,132.08 IC1.10
  Top 0.813: Q21.2 41.53,123.57 41.91,123.83
N$36
  Top 0.813: R15.2 78.74,155.58 76.96,157.35 56.77,157.35 56.78,156.48 D1.1 56.78,159.65 57.78,160.66 C1.1 59.69,161.29
N$37
  Top 0.61: IC1.1 55.88,143.51 55.88,144.78
  Top 0.813: D1.3 | 55.88,144.78 D1.3 | R11.1 60.33,154.31 60.33,154.3 D1.3
N$38
  Top 0.813: ICSP.1 R14.2
N$39
  Top 0.61: 33.66,123.19 36.2,125.73 41.27,125.73 48.9,133.35 IC1.9
  Top 1.27: Q21.1 33.66,123.19
N$40
  Top 0.61: 64.77,145.42 64.14,144.78 64.14,142.88 64.77,142.24 IC1.27
  Top 0.813: R13.2 ICSP.2 71.12,143.51 69.22,145.42 64.77,145.42
  Bottom 0.813: X3.1 17.14,115.57 15.24,117.47 15.24,127 16.51,128.27 29.21,128.27 31.75,125.73 34.29,125.73 34.92,126.36 34.92,130.81 50.16,146.05 72.39,146.05 74.93,143.51 ICSP.2
N$41
  Top 0.61: 25.4,130.81 31.75,137.16 IC1.6
  Top 0.813: X3.4 25.4,130.81
  Top 1.27: R17.2 X3.4
  Bottom 0.61: U$2.6 73.66,173.99 66.04,166.37 50.8,166.37 45.09,160.66 26.04,160.66 24.13,158.75 19.05,158.75 15.62,155.32 15.62,132.08 16.26,131.45 20.32,131.45 X3.4
N$42
  Top 0.61: 30.48,138.43 IC1.5
  Top 0.813: 30.48,138.43 29.84,138.43 27.3,135.89 X3.5
  Top 1.27: R18.2 X3.5
N$43
  Top 0.61: IC1.4 51.44,139.7 50.16,140.97
  Top 0.813: X3.6 50.16,140.97
  Top 1.27: R19.2 X3.6
N$44
  Top 0.61: 46.99,146.05 52.07,140.97 IC1.3
  Top 0.813: X3.7 46.99,146.05
  Top 1.27: R20.2 X3.7
N$45
  Top 0.61: 52.7,142.88 53.34,142.24 IC1.2
  Top 0.813: 52.7,142.88 44.45,151.13 X3.8
  Top 1.27: R21.2 X3.8 | R22.2 96.52,100.33 IN/OUT/OW.2
  Bottom 1.27: IN/OUT/OW.2 96.52,112.78 96.65,113.79 96.65,151.77 86.74,161.67 52.58,161.67 46.99,156.21 29.84,156.21 24.77,151.13 X3.8
N$46
  Bottom 0.61: U$2.3 84.45,173.99 88.27,170.18 TC1.1
N$47
  Top 0.61: R2.2 10.16,161.29 | 10.16,161.29 12.7,161.29 | 10.16,161.29 X3.10
  Top 0.813: IC1.17 67.31,129.54 68.58,128.27 89.53,128.27 95.25,133.99 95.25,157.48 86.36,166.37 52.07,166.37 46.99,161.29 X3.10
N$48  (via drill 1.3 pad 2.54)
  other vias: 90.17,77.47
N$49  (via drill 0.6 pad 1.27)
  Top 0.61: 57.78,127 IC1.14 | v58.17,149.86 58.17,127.13 57.85,126.94 57.78,127 | v42.55,129.54 v45.72,132.72 | 57.78,127 v57.78,123.83
  Bottom 0.61: 34.92,144.78 U$18.6 38.73,144.78 39.37,145.42 39.37,148.59 40.01,149.86 | 51.44,134.62 U$4.6 | U$2.5 75.5,172.66 67.31,164.47 51.44,164.47 45.72,158.75 28.57,158.75 23.5,153.67 18.41,153.67 17.14,152.4 17.14,149.86 18.41,148.59 22.86,148.59 27.94,143.51
  Bottom 0.813: 28.57,144.15 R24.2 29.21,145.42 29.84,146.05 33.66,146.05 34.92,144.78
  Bottom 1.27: JUMPER1.1 27.94,143.51 28.57,144.15 | 40.01,149.86 v58.17,149.86 | 51.44,134.62 50.16,135.89 48.9,135.89 v45.72,132.72 | v42.55,129.54 42.55,124.46 44.45,122.55 56.52,122.55 v57.78,123.83
N$50  (via drill 1.3 pad 2.54)
  other vias: 90.17,63.5
N$52  (via drill 0.6 pad 1.27)
  Top 0.61: v67.31,123.83 67.31,125.09 66.04,126.36 IC1.15 | v33.15,127.63 32.38,127.63 29.21,124.46 29.21,120.65 29.84,120.02 v45.09,120.02
  Bottom 0.406: 68.58,130.18 JUMPER2.1
  Bottom 0.61: 60.33,130.81 50.16,130.81 U$4.5 | 32.38,144.15 33.02,143.51 | 36.83,143.51 U$18.5 32.38,143.51 32.38,144.15 | v33.15,127.63 33.02,127.63 | 67.94,130.81 68.58,130.18 | 32.38,144.15 R23.2
  Bottom 1.27: 33.02,127.63 31.11,129.54 31.11,139.06 32.38,140.34 32.38,143.51 | v45.09,120.02 64.77,120.02 67.31,122.55 v67.31,123.83 60.33,130.81 67.94,130.81
N$53
  Bottom 0.61: U$4.2 52.7,125.73 Q22.1
N$54
  Bottom 0.61: Q22.2 U$4.1
N$55
  Bottom 0.61: 76.2,111.76 330.1 | LED12.- 71.12,111.76
  Bottom 1.27: 71.12,111.76 76.2,111.76
N$56
  Bottom 0.61: U$4.3 51.44,129.54 56.52,129.54 57.78,128.27
  Bottom 1.27: 57.78,128.27 BAT1.P$1
N$58  (via drill 1.3 pad 2.54)
  other vias: 90.17,48.26
N$60  (via drill 1.3 pad 2.54)
  other vias: 17.78,82.55
N$61  (via drill 1.3 pad 2.54)
  other vias: 90.17,36.2
N$62
  Top 1.016: VR3.1 31.45,165.4 31.75,164.47 33.66,164.47
  Top 1.27: VR4.1 38.73,165.74 37.47,164.47 33.66,164.47 C4.1
  Bottom 1.27: POLYFUSE1.2 80.01,3.81 78.74,2.54 13.34,2.54 12.7,3.17 12.7,16.51 4.19,25.15 4.19,73.41 10.16,79.38 10.16,100.96 4.45,106.55 4.45,118.74 10.16,124.46 10.16,156.84 13.34,160.02 13.34,164.47 16.51,167.64 31.11,167.64 33.02,165.74 38.1,165.74 VR4.1 38.73,165.74
N$63
  Top 1.27: C3.1 91.31,110.99 91.44,111.12 POLYFUSE2.2 VR1.1 80.24,111.1 VR2.1
N$64
  Top 1.27: LEDR10.1 81.92,10.79 82.07,10.64 LED10.+
N$65
  Top 1.27: LEDR9.1 81.92,20.32 82.07,20.17 LED9.+
N$66
  Top 1.27: LED11.- 68.58,175.26 68.71,175.39 1.1
N$67
  Top 1.27: LEDR8.1 81.92,30.48 82.07,30.33 LED8.+
N$68
  Top 1.016: VR3.3 18.11,165.41 16.51,167.01 X5.1
  Top 1.27: X5.1 16.51,175.9 18.41,177.8 26.67,177.8 | 26.67,177.8 36.83,177.8 | 36.83,177.8 46.99,177.8 | 46.99,177.8 57.15,177.8 | 26.67,177.8 X5.3 | 36.83,177.8 X5.5 | 46.99,177.8 X5.7 | 57.15,177.8 X5.9 | 57.15,177.8 65.41,177.8 | 65.41,177.8 76.83,177.8 78.74,175.9 78.74,173.36 100UF1.+ | LED11.+ 66.19,172.57 65.41,173.36 65.41,177.8
  Bottom 1.27: VR4.3 43.81,167.64 46.99,170.81 X5.7
N$69
  Top 1.27: LEDR7.1 82.55,40.64 82.07,40.16 LED7.+
N$70
  Top 1.27: LED6.+ 81.92,48.26 82.75,47.42 LEDR6.1
N$71
  Top 1.27: LED5.+ 82.68,59.31 82.63,58.75 LEDR5.1
N$72
  Top 1.27: LEDR4.1 82.55,74.3 82.7,74.14 LED4.+
N$73
  Top 1.27: LEDR3.1 82.55,84.45 82.7,84.3 LED3.+
N$74
  Top 1.27: LED2.+ 82.55,92.08 82.75,92.28 LEDR2.1
N$75
  Top 1.27: LED1.+ 82.7,100.48 82.55,100.33 82.55,99.69 LEDR1.1
N$76
  pour Bottom: 95.89,24.13 96.52,24.77 87.63,24.77
N$77  (via drill 1.3 pad 2.54)
  other vias: 18.41,33.66
N$78  (via drill 1.3 pad 2.54)
  other vias: 18.41,50.8
N$79  (via drill 1.3 pad 2.54)
  other vias: 18.41,62.23
N$80
  Top 0.61: U$1.5 17.14,93.98 18.41,92.71 18.41,92.08 C6.2
N$81  (via drill 0.6)
  Top 0.61: v13.72,93.09 14.61,93.98 U$1.3 14.61,96.52 | 12.83,82.42 12.7,82.55 | 12.83,82.42 C5.2 | v13.84,78.61 13.84,81.41 12.83,82.42
  Bottom 0.61: v13.72,93.09 13.72,78.99 v13.84,78.61
N$82
  Top 0.61: C6.1 15.74,91.57 15.88,92.08 U$1.4 15.88,96.52
N$83
  Top 0.61: C5.1 9.53,82.55 9.53,93.98 12.06,96.52 U$1.1
N$84
  Top 0.61: C7.1 12.06,88.27 11.56,88.9 11.56,93.47 13.34,95.25 U$1.2 13.34,96.52
N$85
  Top 0.61: U$1.6 18.41,95.25 20.32,93.34 20.32,88.27 C8.2
N$86
  Top 0.61: R1.2 3.81,100.58 3.81,119.38 5.33,120.9 5.33,156.34 5.84,156.84 20.32,156.84 X3.9
  Top 0.813: IC1.18 68.58,130.81 69.22,130.18 88.27,130.18 92.71,134.62 92.71,155.58 84.45,163.83 53.34,163.83 45.72,156.21 X3.9 20.32,156.21
N$87
  Top 0.61: R1.1 9.96,97.58 10.79,98.42 19.68,98.42 20.95,99.69 U$1.9
N$88
  Top 0.61: U$1.14 14.61,99.69 7.62,99.69 5.46,101.85 5.46,117.35 7.37,119.13 7.62,119.38 7.62,154.64 R2.1
N$89
  Top 0.61: 18.41,101.6 U$1.11 RS232.1
N$90
  Top 0.61: U$1.8 20.95,96.52 22.86,98.42 22.86,103.5 RS232.2
(copper drawn outside any net)
  shapes: Bottom area x4

### Text on the board
tPlace: Dan Jubenville 2009 | - | + | - | +
bPlace: Dan Jubenville 2009